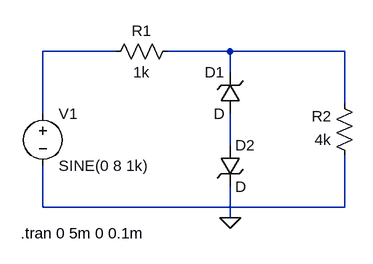
[diagram p0: schematic Ejercicio 2.asc]
Ejercicio 2.asc, the LTspice schematic file:
Version 4
SHEET 1 880 680
WIRE 32 64 -80 64
WIRE 208 64 112 64
WIRE 384 64 208 64
WIRE 208 96 208 64
WIRE 384 144 384 64
WIRE -80 160 -80 64
WIRE 208 208 208 160
WIRE -80 304 -80 240
WIRE 384 304 384 224
WIRE 384 304 -80 304
WIRE 208 320 208 272
FLAG 208 320 0
SYMBOL zener 192 208 R0
SYMATTR InstName D2
SYMBOL res 128 48 R90
WINDOW 0 0 56 VBottom 2
WINDOW 3 32 56 VTop 2
SYMATTR InstName R1
SYMATTR Value 1k
SYMBOL res 400 240 R180
WINDOW 0 36 76 Left 2
WINDOW 3 36 40 Left 2
SYMATTR InstName R2
SYMATTR Value 4k
SYMBOL voltage -80 144 R0
WINDOW 123 0 0 Left 0
WINDOW 39 0 0 Left 0
SYMATTR InstName V1
SYMATTR Value SINE(0 8 1k)
SYMBOL zener 224 160 R180
WINDOW 0 24 64 Left 2
WINDOW 3 24 0 Left 2
SYMATTR InstName D1
TEXT -114 344 Left 2 !.tran 0 5m 0 0.1m

The netlist it stands for:
* Ejercicio 2.asc
D2 N003 0 D
R1 N002 N001 1k
R2 N004 N002 4k
V1 N001 N004 SINE(0 8 1k)
D1 N003 N002 D
.model D D
.lib standard.dio
.tran 0 5m 0 0.1m
.backanno
.end